# EAGLE design Dice (EAGLE 7.7.0)
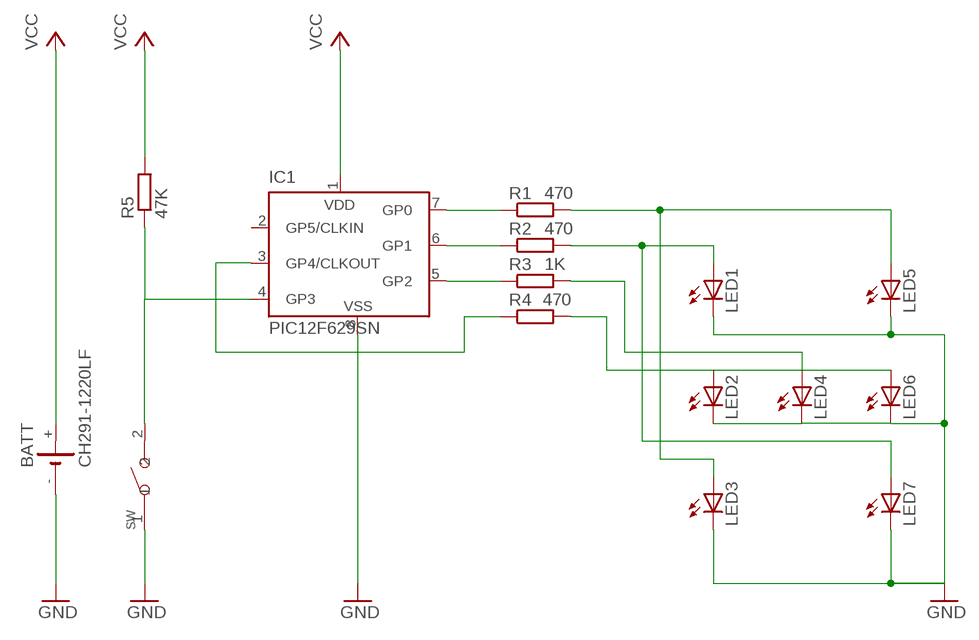
[diagram p0: schematic, sheet 1]

## Parts
BATT  CH291-1220LF  [CH291-1220LF]
IC1  PIC12F629SN  [SO-08]
LED1  LEDCHIPLED_0805  [CHIPLED_0805]
LED2  LEDCHIPLED_0805  [CHIPLED_0805]
LED3  LEDCHIPLED_0805  [CHIPLED_0805]
LED4  LEDCHIPLED_0805  [CHIPLED_0805]
LED5  LEDCHIPLED_0805  [CHIPLED_0805]
LED6  LEDCHIPLED_0805  [CHIPLED_0805]
LED7  LEDCHIPLED_0805  [CHIPLED_0805]
R1  470  R-EU_R0805  [R0805]
R2  470  R-EU_R0805  [R0805]
R3  1K  R-EU_R0805  [R0805]
R4  470  R-EU_R0805  [R0805]
R5  47K  R-EU_R0805  [R0805]
SW  SMD-BUTTON(2P-6.0X3.0X2.5MM)-DHT-1163S  [SW2-4.0-6.0X3.0X2.5MM]

## Nets
GND: BATT.- IC1.8(VSS) LED1.C LED2.C LED3.C LED4.C LED5.C LED6.C LED7.C SW.1
GP0: IC1.7(GP0) R1.1
GP1: IC1.6(GP1) R2.1
GP2: IC1.5(GP2) R3.1
GP3: IC1.4(GP3) R5.1 SW.2
GP4: IC1.3(GP4/CLKOUT) R4.1
LED1&7: LED1.A LED7.A R2.2
LED2&6: LED2.A LED6.A R4.2
LED3&5: LED3.A LED5.A R1.2
LED4: LED4.A R3.2
VCC: BATT.+ IC1.1(VDD) R5.2
Unconnected: IC1.2(GP5/CLKIN)

## Library data of the parts
BATT = battery:CH291-1220LF: Battery Holder, SMT, 12mm multicomp PART NO. CH291-1220LF Source: Data sheet <http://www.farnell.com/datasheets/1505860.pdf>
IC1 = microchip:PIC12F6*: Data Sheet 8-Pin FLASH-Based 8-Bit CMOS Microcontrollers Source: http://www.microchip.com .. 41190c.pdf; MF: MICROCHIP; MPN: PIC12F629-I/SN; OC_FARNELL: 9759000; OC_NEWARK: 61K3433
LED1-LED7 = led:LED: LED OSRAM: - CHIPLED LG R971, LG N971, LY N971, LG Q971, LY Q971, LO R971, LY R971 LH N974, LH R974 LS Q976, LO Q976, LY Q976 LO Q996 - Hyper CHIPLED LW Q18S LB Q993, LB Q99A, LB R99A - SideLED LS A670, LO A670, LY A670, LG A670, LP A670 LB A673, LV A673, LT A673, LW A673 LH A674 LY A675 LS A676, LA A676, LO A676, LY A676, LW A676 LS A679, LY A679, LG A679 - Hyper Micro SIDELED® LS Y876, LA Y876, LO Y876, LY Y876 LT Y87S - SmartLED LW L88C, LW L88S LB L89C, LB L89S, LG L890 LS L89K, LO L89K, LY L89K LS L896, LA L896, LO L896, LY L896 - TOPLED LS T670, LO T670, LY T670, LG T670, LP T670 LSG T670, LSP T670, LSY T670, LOP T670, LYG T670 LG T671, LOG T671, LSG T671 LB T673, LV T673, LT T673, LW T673 LH T674 LS T676, LA T676, LO T676, LY T676, LB T676, LH T676, LSB T676, LW T676 LB T67C, LV T67C, LT T67C, LS T67K, LO T67K, LY T67K, LW E67C LS E67B, LA E67B, LO E67B, LY E67B, LB E67C, LV E67C, LT E67C LW T67C LS T679, LY T679, LG T679 LS T770, LO T770, LY T770, LG T770, LP T770 LB T773, LV T773, LT T773, LW T773 LH T774 LS E675, LA E675, LY E675, LS T675 LS T776, LA T776, LO T776, LY T776, LB T776 LHGB T686 LT T68C, LB T68C - Hyper Mini TOPLED® LB M676 - Mini TOPLED Santana® LG M470 LS M47K, LO M47K, LY M47K Source: http://www.osram.convergy.de LUXEON: - LUMILED® LXK2-PW12-R00, LXK2-PW12-S00, LXK2-PW14-U00, LXK2-PW14-V00 LXK2-PM12-R00, LXK2-PM12-S00, LXK2-PM14-U00 LXK2-PE12-Q00, LXK2-PE12-R00, LXK2-PE12-S00, LXK2-PE14-T00, LXK2-PE14-U00 LXK2-PB12-K00, LXK2-PB12-L00, LXK2-PB12-M00, LXK2-PB14-N00, LXK2-PB14-P00, LXK2-PB14-Q00 LXK2-PR12-L00, LXK2-PR12-M00, LXK2-PR14-Q00, LXK2-PR14-R00 LXK2-PD12-Q00, LXK2-PD12-R00, LXK2-PD12-S00 LXK2-PH12-R00, LXK2-PH12-S00 LXK2-PL12-P00, LXK2-PL12-Q00, LXK2-PL12-R00 Source: www.luxeon.com KINGBRIGHT: KA-3528ASYC Source: www.kingbright.com
R1-R5 = resistor:R-EU_: RESISTOR, European symbol
SW = Seeed-OPL-Switch:SMD-BUTTON(2P-6.0X3.0X2.5MM): 311020029

## Board
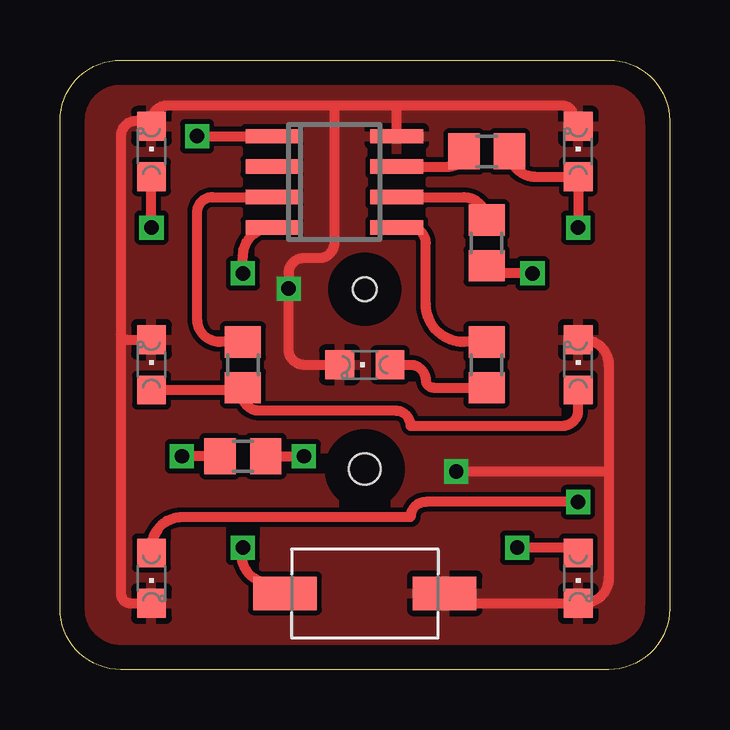
[diagram p1: board, top side]
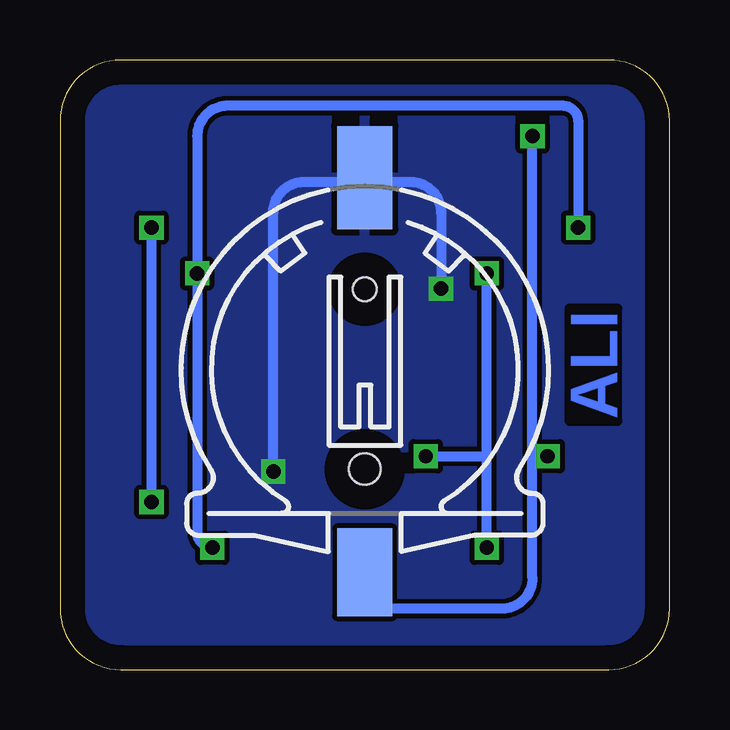
[diagram p2: board, bottom side, seen from below]

Size 25.4 x 25.4 mm. Coordinates in mm from the lower left corner, seen from the top.
Outline: 2.54,25.4 22.86,25.4 arc-90 25.4,22.86 25.4,2.54 arc-90 22.86,0 2.54,0 arc-90 0,2.54 0,22.86 arc-90 2.54,25.4
Copper layers (1*16): Top 0.035mm / dielectric 1.5mm / Bottom 0.035mm
Design rules "default *": minimum track width 10mil, minimum drill 23mil, track to track 8mil, track to pad 16mil, pad to pad 8mil, via to via 8mil, smd to smd 8mil, copper to edge 40mil, drill to drill 8mil, minimum pad ring 10mil, minimum via ring 8mil, stop-mask expansion 4mil, vias tented up to drill 0mil, thermal gap 10mil

### Footprints (pad centres in the part's own frame; a part is rotated, then mirrored left to right if it is on the bottom)
CH291-1220LF = smd 2.3 x 3.66: + 0,-2.296 | smd 2.3 x 4.3: - 0,14.146 | hole 1.3: 0,2 | hole 1: 0,9.5
SO-08 = smd 0.6 x 2.2: 1 -1.905,-2.6; 2 -0.635,-2.6; 3 0.635,-2.6; 4 1.905,-2.6; 5 1.905,2.6; 6 0.635,2.6; 7 -0.635,2.6; 8 -1.905,2.6
CHIPLED_0805 = smd 1.2 x 1.2: A 0,-1.05; C 0,1.05
R0805 = smd 1.3 x 1.5: 1 -0.95,0; 2 0.95,0
SW2-4.0-6.0X3.0X2.5MM = smd 2.65 x 1.4: 1 -3.325,0; 2 3.325,0

### Placement (x,y rotation side)
BATT  12.7,6.35 0 bottom
IC1  11.43,20.32 270 top
LED1  3.81,21.59 0 top
LED2  3.81,12.7 0 top
LED3  3.81,3.81 180 top
LED4  12.7,12.7 90 top
LED5  21.59,21.59 0 top
LED6  21.59,12.7 0 top
LED7  21.59,3.81 180 top
R1  17.78,21.59 0 top
R2  17.78,17.78 270 top
R3  17.78,12.7 270 top
R4  7.62,12.7 270 top
R5  7.62,8.89 180 top
SW  12.7,3.17 180 top

### Tracks (layer width: path | path; a pad name or v marks a point on that pad's centre or on a via)
GND  (via drill 0.6)
  Top 0.254: LED5.C arc90 21.37,22.86 | 4.03,22.86 arc90 LED1.C | LED2.C arc90 3.59,13.97
  Top 0.406: 21.37,22.86 21.37,23.08 arc90 20.95,23.5 13.97,23.5 | 13.97,23.5 11.43,23.5 | 13.97,22.29 arc90 IC1.8 14.03,23.43 arc90 13.97,23.5 | 4.03,22.86 3.81,22.86 | 3.81,22.86 3.17,22.86 arc90 2.54,22.23 2.54,13.97 | 2.54,13.97 2.54,3.17 arc90 2.96,2.76 LED3.C | 2.54,13.97 arc90 2.76,13.75 LED2.C | 11.43,23.5 11.43,17.78 arc-90 10.79,17.14 10.16,17.14 arc90 9.53,16.51 v9.53,15.88 9.53,13.34 arc90 10.16,12.7 LED4.C | 21.81,13.75 arc-90 22.86,12.7 22.86,8.26 | 22.86,8.26 22.86,3.81 arc-90 21.81,2.76 LED7.C 16.44,2.76 arc-90 SW.1 | v16.51,8.26 22.86,8.26 | 11.43,23.5 4.45,23.5 arc90 3.81,22.86 | 3.81,22.86 LED1.C
  Bottom 0.406: BATT.- 12.7,20.32 10.79,20.32 arc90 9.53,19.05 v9.53,15.88 | 12.88,20.32 arc-90 BATT.- | v16.51,8.26 16.51,19.05 arc90 15.24,20.32 12.88,20.32 | 12.88,20.32 arc-90 BATT.-
  pour Top: 22.56,0 2.84,0 arc-90 0,2.84 0,22.56 arc-90 2.84,25.4 22.56,25.4 arc-90 25.4,22.56 25.4,2.84 arc-90
  pour Bottom: 22.56,0 2.84,0 arc-90 0,2.84 0,22.56 arc-90 2.84,25.4 22.56,25.4 arc-90 25.4,22.56 25.4,2.84 arc-90
GP0
  Top 0.406: IC1.7 16.2,20.95 arc90 R1.1
GP1
  Top 0.406: IC1.6 16.82,19.68 arc-90 R2.1
GP2
  Top 0.406: R3.1 16.83,13.65 arc-90 15.24,15.24 15.24,17.78 arc90 14.61,18.41 IC1.5
GP3  (via drill 0.6)
  Top 0.406: SW.2 arc-90 8.89,3.66 8.4,3.66 arc-90 v7.62,5.08 | v7.62,16.51 7.62,17.2 arc-90 IC1.4 | R5.1 v10.16,8.89
  Bottom 0.406: v10.16,8.89 7.62,8.89 | 7.62,8.89 v7.62,16.51 | v7.62,5.08 7.62,8.89
GP4
  Top 0.406: R4.1 6.67,13.65 arc-90 5.71,14.61 5.71,19.05 arc-90 6.35,19.68 IC1.3
LED1&7  (via drill 0.6)
  Top 0.254: 18.1,16.51 arc-90 R2.2 arc90 18.1,16.51
  Top 0.406: LED7.A arc90 21.37,5.08 v19.05,5.08 | v19.68,16.51 18.1,16.51 arc-90 R2.2 | v3.81,18.41 LED1.A
  Bottom 0.406: v19.05,5.08 arc90 19.68,5.71 v19.68,16.51 19.68,22.23 arc90 18.41,23.5 4.45,23.5 arc90 3.81,22.86 v3.81,18.41
LED2&6
  Top 0.254: R4.2 arc-90 7.52,11.65 | 21.59,11.43 LED6.A
  Top 0.406: 7.52,11.65 LED2.A | R4.2 7.62,11.43 arc90 8.26,10.79 13.97,10.79 arc-90 14.61,10.16 20.95,10.16 arc90 21.59,10.79 LED6.A
LED3&5  (via drill 0.6)
  Top 0.406: R1.2 arc90 19.78,20.54 LED5.A v21.59,18.41 | v21.59,6.99 15.24,6.99 arc90 14.61,6.35 5.08,6.35 arc90 3.81,5.08 LED3.A
  Bottom 0.406: v21.59,18.41 v21.59,6.99
LED4
  Top 0.406: LED4.A 14.61,12.7 arc-90 15.24,12.06 arc90 15.55,11.75 R3.2
VCC  (via drill 0.6)
  Top 0.406: v5.71,22.23 IC1.1 | R5.2 v5.08,8.89
  Bottom 0.406: 5.71,8.89 5.71,3.81 arc90 6.99,2.54 12.7,2.54 BATT.+ 12.7,3.81 | 5.71,8.89 v5.71,22.23 | v5.08,8.89 5.71,8.89

### Text on the board
Bottom: ALI